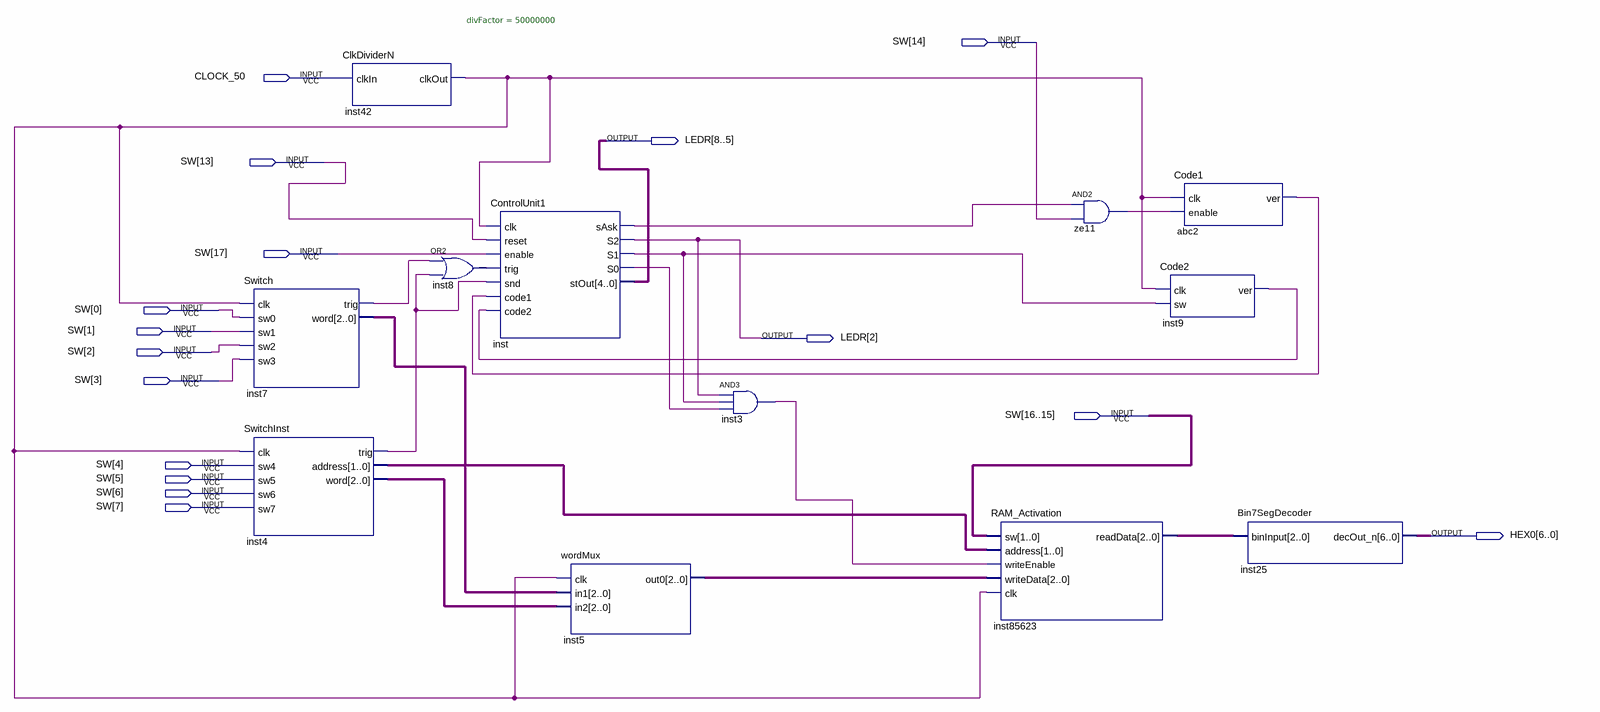
[diagram p0: schematic sheet]
// Quartus schematic BlockTeste.bdf as structural Verilog: 12 symbols, 16 pins
module BlockTeste (
  input  [17:0] SW,
  input  CLOCK_50,
  output [8:2] LEDR,
  output [6:0] HEX0
);

  wire abc2_ver, inst3_out, inst4_trig, inst7_trig, inst8_out, inst9_ver, inst42_clkout, inst_s0, inst_s1,
       inst_sask, ze11_out;
  wire [1:0] inst4_address;
  wire [2:0] inst4_word, inst5_out0, inst7_word, inst85623_readdata;

  Switch inst7 (
    .clk(inst42_clkout), .sw0(SW[0]), .sw1(SW[1]), .sw2(SW[2]), .sw3(SW[3]), .trig(inst7_trig),
    .word(inst7_word));
  SwitchInst inst4 (
    .clk(inst42_clkout), .sw4(SW[4]), .sw5(SW[5]), .sw6(SW[6]), .sw7(SW[7]), .trig(inst4_trig),
    .address(inst4_address), .word(inst4_word));
  ClkDividerN #(.divFactor(50000000)) inst42 (.clkIn(CLOCK_50), .clkOut(inst42_clkout));
  or inst8 (inst8_out, inst7_trig, inst4_trig);
  ControlUnit1 inst (
    .clk(inst42_clkout), .reset(SW[13]), .enable(SW[17]), .trig(inst8_out), .snd(inst4_trig),
    .code1(abc2_ver), .code2(inst9_ver), .sAsk(inst_sask), .S2(LEDR[2]), .S1(inst_s1), .S0(inst_s0),
    .stOut(LEDR[8:5]));
  wordMux inst5 (.clk(inst42_clkout), .in1(inst7_word), .in2(inst4_word), .out0(inst5_out0));
  and inst3 (inst3_out, LEDR[2], inst_s1, inst_s0);
  RAM_Activation inst85623 (
    .sw(SW[16:15]), .address(inst4_address), .writeEnable(inst3_out), .writeData(inst5_out0),
    .clk(inst42_clkout), .readData(inst85623_readdata));
  and ze11 (ze11_out, inst_sask, SW[14]);
  Code1 abc2 (.clk(inst42_clkout), .enable(ze11_out), .ver(abc2_ver));
  Code2 inst9 (.clk(inst42_clkout), .sw(inst_s1), .ver(inst9_ver));
  Bin7SegDecoder inst25 (.binInput(inst85623_readdata), .decOut_n(HEX0));
endmodule
